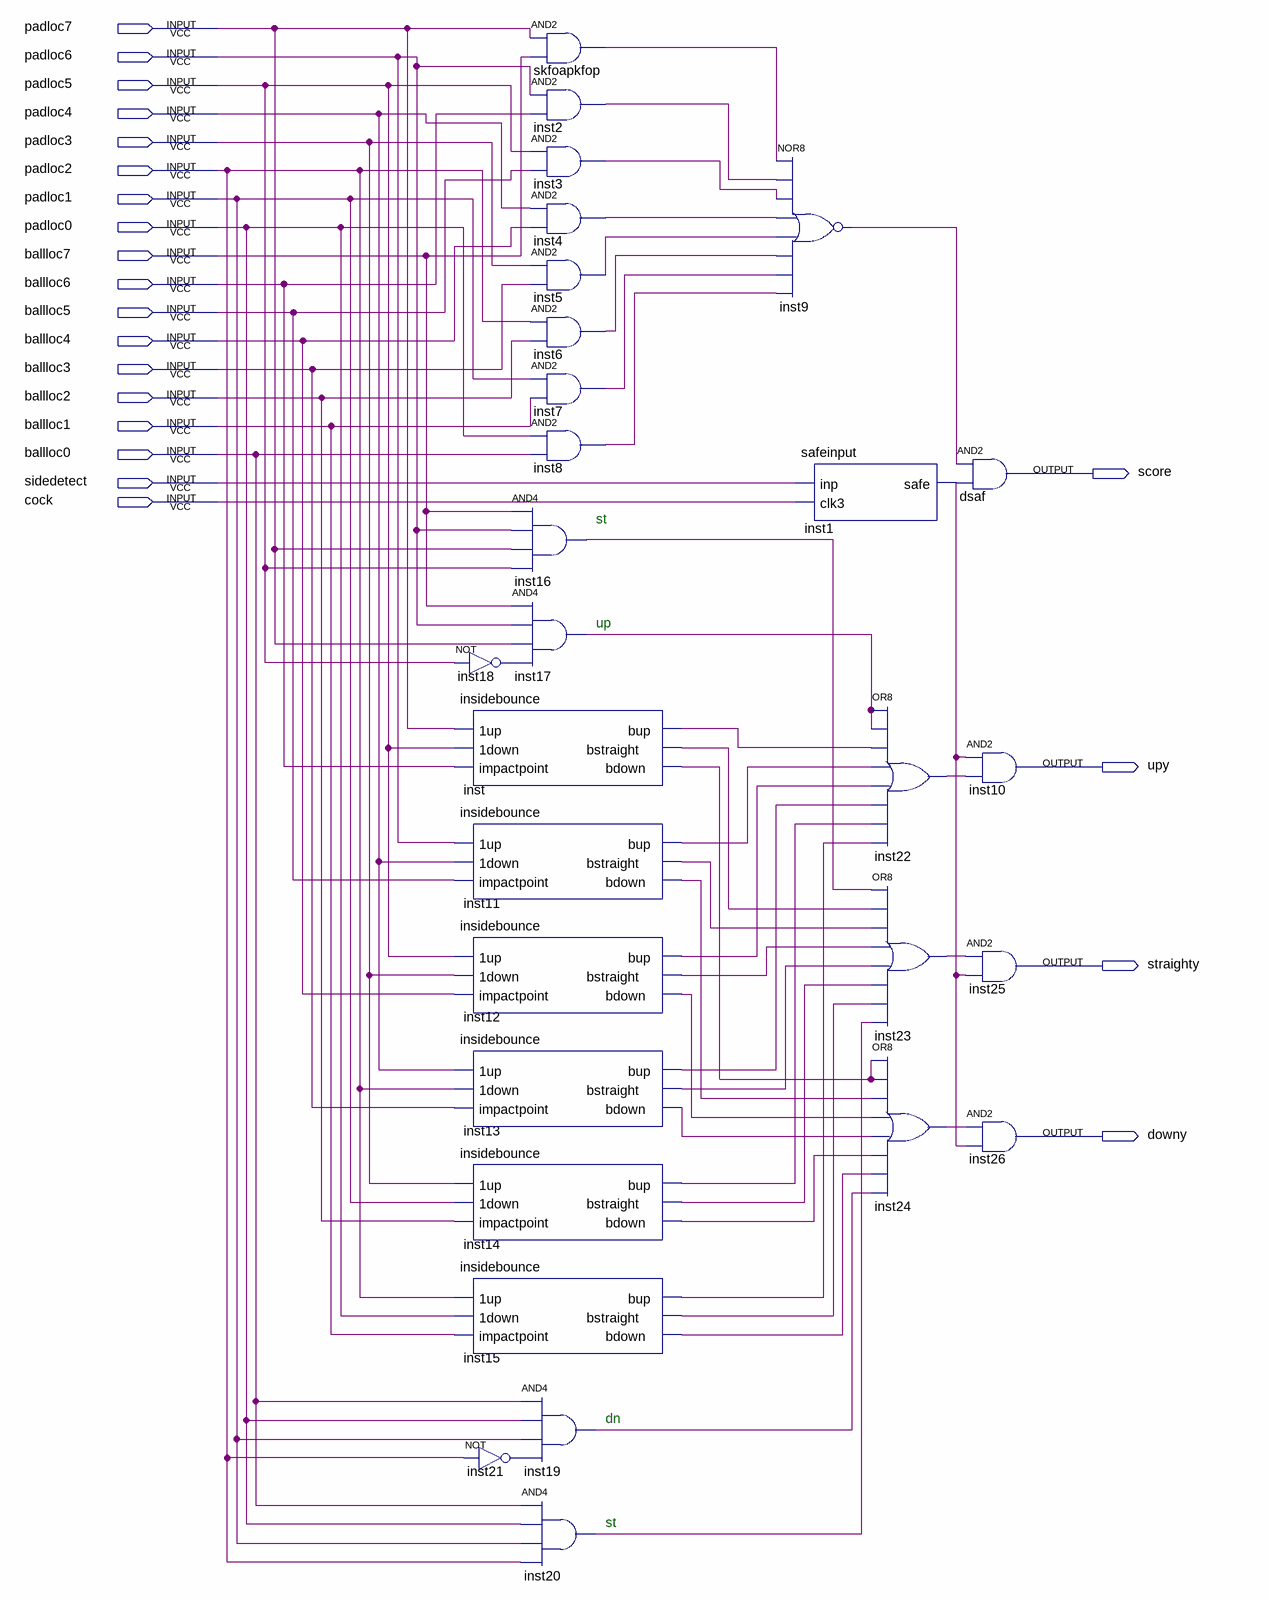
[diagram p0: schematic sheet]
// Quartus schematic checkifscore.bdf as structural Verilog: 29 symbols, 22 pins
module checkifscore (
  input  padloc7,
  input  padloc6,
  input  padloc5,
  input  padloc4,
  input  padloc3,
  input  padloc2,
  input  padloc1,
  input  padloc0,
  input  ballloc7,
  input  ballloc6,
  input  ballloc5,
  input  ballloc4,
  input  ballloc3,
  input  ballloc2,
  input  ballloc1,
  input  ballloc0,
  input  sidedetect,
  input  cock,
  output score,
  output upy,
  output straighty,
  output downy
);

  wire inst1_safe, inst2_out, inst3_out, inst4_out, inst5_out, inst6_out, inst7_out, inst8_out, inst9_out,
       inst11_bdown, inst11_bstraight, inst11_bup, inst12_bdown, inst12_bstraight, inst12_bup, inst13_bdown,
       inst13_bstraight, inst13_bup, inst14_bdown, inst14_bstraight, inst14_bup, inst15_bdown,
       inst15_bstraight, inst15_bup, inst16_out, inst17_out, inst18_out, inst19_out, inst20_out, inst21_out,
       inst22_out, inst23_out, inst24_out, inst_bdown, inst_bstraight, inst_bup, skfoapkfop_out;

  not inst18 (inst18_out, padloc5);
  insidebounce inst (
    .\1up (padloc7), .\1down (padloc5), .impactpoint(ballloc6), .bup(inst_bup), .bstraight(inst_bstraight),
    .bdown(inst_bdown));
  insidebounce inst11 (
    .\1up (padloc6), .\1down (padloc4), .impactpoint(ballloc5), .bup(inst11_bup),
    .bstraight(inst11_bstraight), .bdown(inst11_bdown));
  insidebounce inst12 (
    .\1up (padloc5), .\1down (padloc3), .impactpoint(ballloc4), .bup(inst12_bup),
    .bstraight(inst12_bstraight), .bdown(inst12_bdown));
  insidebounce inst13 (
    .\1up (padloc4), .\1down (padloc2), .impactpoint(ballloc3), .bup(inst13_bup),
    .bstraight(inst13_bstraight), .bdown(inst13_bdown));
  insidebounce inst14 (
    .\1up (padloc3), .\1down (padloc1), .impactpoint(ballloc2), .bup(inst14_bup),
    .bstraight(inst14_bstraight), .bdown(inst14_bdown));
  insidebounce inst15 (
    .\1up (padloc2), .\1down (padloc0), .impactpoint(ballloc1), .bup(inst15_bup),
    .bstraight(inst15_bstraight), .bdown(inst15_bdown));
  not inst21 (inst21_out, padloc2);
  and skfoapkfop (skfoapkfop_out, padloc7, ballloc7);
  and inst2 (inst2_out, padloc6, ballloc6);
  and inst3 (inst3_out, padloc5, ballloc5);
  and inst4 (inst4_out, padloc4, ballloc4);
  and inst5 (inst5_out, padloc3, ballloc3);
  and inst6 (inst6_out, padloc2, ballloc2);
  and inst7 (inst7_out, padloc1, ballloc1);
  and inst8 (inst8_out, padloc0, ballloc0);
  and inst16 (inst16_out, ballloc7, padloc6, padloc7, padloc5);
  and inst17 (inst17_out, ballloc7, padloc6, padloc7, inst18_out);
  and inst19 (inst19_out, ballloc0, padloc0, padloc1, inst21_out);
  and inst20 (inst20_out, ballloc0, padloc0, padloc1, padloc2);
  nor inst9 (inst9_out, skfoapkfop_out, inst2_out, inst3_out, inst4_out, inst5_out, inst6_out, inst7_out, inst8_out);
  safeinput inst1 (.inp(sidedetect), .clk3(cock), .safe(inst1_safe));
  or inst22 (inst22_out, inst17_out, inst17_out, inst_bup, inst11_bup, inst12_bup, inst13_bup, inst14_bup, inst15_bup);
  or inst23 (inst23_out, inst16_out, inst_bstraight, inst11_bstraight, inst12_bstraight, inst13_bstraight, inst14_bstraight, inst15_bstraight, inst20_out);
  or inst24 (inst24_out, inst_bdown, inst_bdown, inst11_bdown, inst12_bdown, inst13_bdown, inst14_bdown, inst15_bdown, inst19_out);
  and dsaf (score, inst9_out, inst1_safe);
  and inst10 (upy, inst1_safe, inst22_out);
  and inst25 (straighty, inst23_out, inst1_safe);
  and inst26 (downy, inst24_out, inst1_safe);

  // Notes on the sheet:
  //   st
  //   up
  //   dn
  //   st
endmodule
